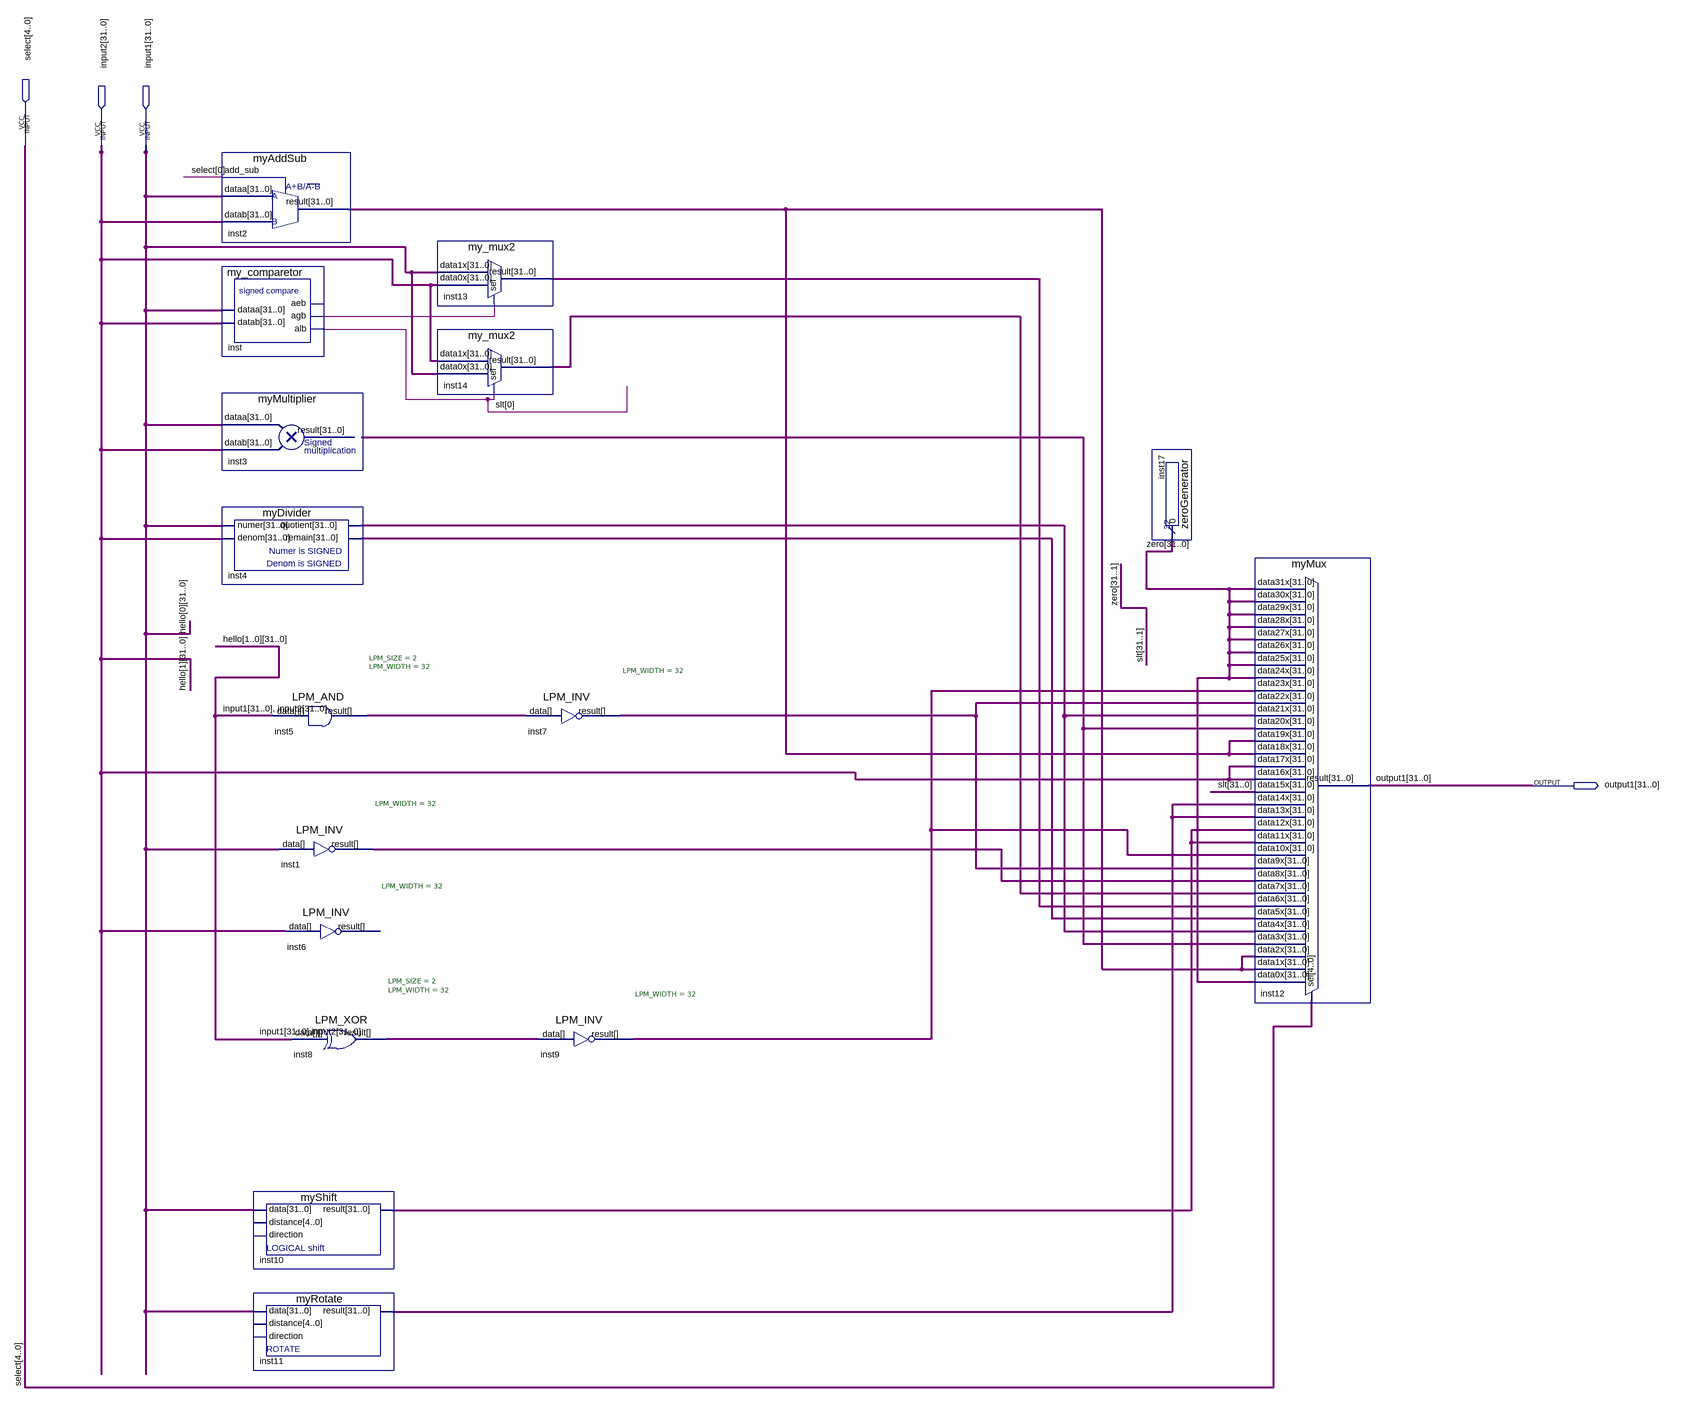
[diagram p0: schematic sheet]
// Quartus schematic test.bdf as structural Verilog: 16 symbols, 4 pins
module test (
  input  [4:0] select,
  input  [31:0] input2,
  input  [31:0] input1,
  output [31:0] output1
);

  wire inst_agb;
  wire [31:0] inst1_result, inst2_result, inst3_result, inst4_quotient, inst4_remain, inst5_result,
       inst7_result, inst8_result, inst9_result, inst10_result, inst11_result, inst13_result, inst14_result,
       slt, zero;

  myAddSub inst2 (.add_sub(select[0]), .dataa(input1), .datab(input2), .result(inst2_result));
  my_comparetor inst (.dataa(input1), .datab(input2), .agb(inst_agb), .alb(slt[0]));  // open: aeb
  myMultiplier inst3 (.dataa(input1), .datab(input2), .result(inst3_result));
  myDivider inst4 (.numer(input1), .denom(input2), .quotient(inst4_quotient), .remain(inst4_remain));
  LPM_AND #(.LPM_SIZE(2), .LPM_WIDTH(32)) inst5 (.data({input1, input2}), .result(inst5_result));
  LPM_INV #(.LPM_WIDTH(32)) inst1 (.data(input1), .result(inst1_result));
  LPM_INV #(.LPM_WIDTH(32)) inst6 (.data(input2));  // open: result
  myShift inst10 (.data(input1), .result(inst10_result));  // open: distance, direction
  myRotate inst11 (.data(input1), .result(inst11_result));  // open: distance, direction
  LPM_XOR #(.LPM_SIZE(2), .LPM_WIDTH(32)) inst8 (.data({input1, input2}), .result(inst8_result));
  my_mux2 inst13 (.data1x(input1), .data0x(input2), .sel(inst_agb), .result(inst13_result));
  my_mux2 inst14 (.data1x(input2), .data0x(input1), .sel(slt[0]), .result(inst14_result));
  LPM_INV #(.LPM_WIDTH(32)) inst7 (.data(inst5_result), .result(inst7_result));
  LPM_INV #(.LPM_WIDTH(32)) inst9 (.data(inst8_result), .result(inst9_result));
  zeroGenerator inst17 (.result(zero));
  myMux inst12 (
    .data31x(zero), .data30x(zero), .data29x(zero), .data28x(zero), .data27x(zero), .data26x(zero),
    .data25x(zero), .data24x(zero), .data23x(inst9_result), .data22x(inst7_result), .data21x(inst4_quotient),
    .data20x(inst3_result), .data19x(inst2_result), .data18x(inst2_result), .data17x(input2),
    .data16x(input2), .data15x(slt), .data14x(inst11_result), .data13x(inst11_result),
    .data12x(inst10_result), .data11x(inst10_result), .data10x(inst9_result), .data9x(inst7_result),
    .data8x(inst1_result), .data7x(inst14_result), .data6x(inst13_result), .data5x(inst4_remain),
    .data4x(inst4_quotient), .data3x(inst3_result), .data2x(inst2_result), .data1x(inst2_result),
    .data0x(zero), .sel(select), .result(output1));

  // Other names for the same wires on the sheet: hello_1[31:0] = input2; hello_0[31:0] = input1
endmodule
